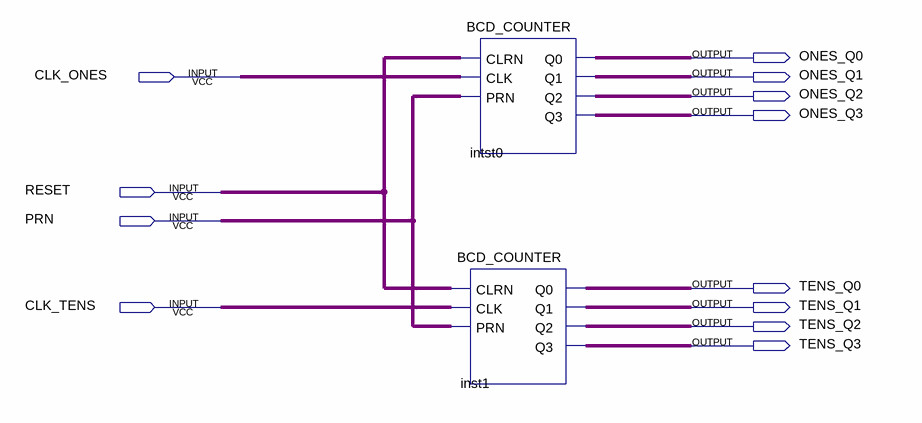
[diagram p0: schematic sheet]
// Quartus schematic TOW_DIGITS_BCD_COUNTER.bdf as structural Verilog: 2 symbols, 12 pins
module TOW_DIGITS_BCD_COUNTER (
  input  CLK_ONES,
  input  RESET,
  input  PRN,
  input  CLK_TENS,
  output ONES_Q0,
  output ONES_Q1,
  output ONES_Q2,
  output ONES_Q3,
  output TENS_Q0,
  output TENS_Q1,
  output TENS_Q2,
  output TENS_Q3
);

  BCD_COUNTER intst0 (.CLRN(RESET), .CLK(CLK_ONES), .PRN(PRN), .Q0(ONES_Q0), .Q1(ONES_Q1), .Q2(ONES_Q2), .Q3(ONES_Q3));
  BCD_COUNTER inst1 (.CLRN(RESET), .CLK(CLK_TENS), .PRN(PRN), .Q0(TENS_Q0), .Q1(TENS_Q1), .Q2(TENS_Q2), .Q3(TENS_Q3));
endmodule
